# EAGLE board BMS_24 (EAGLE 9.6.2)
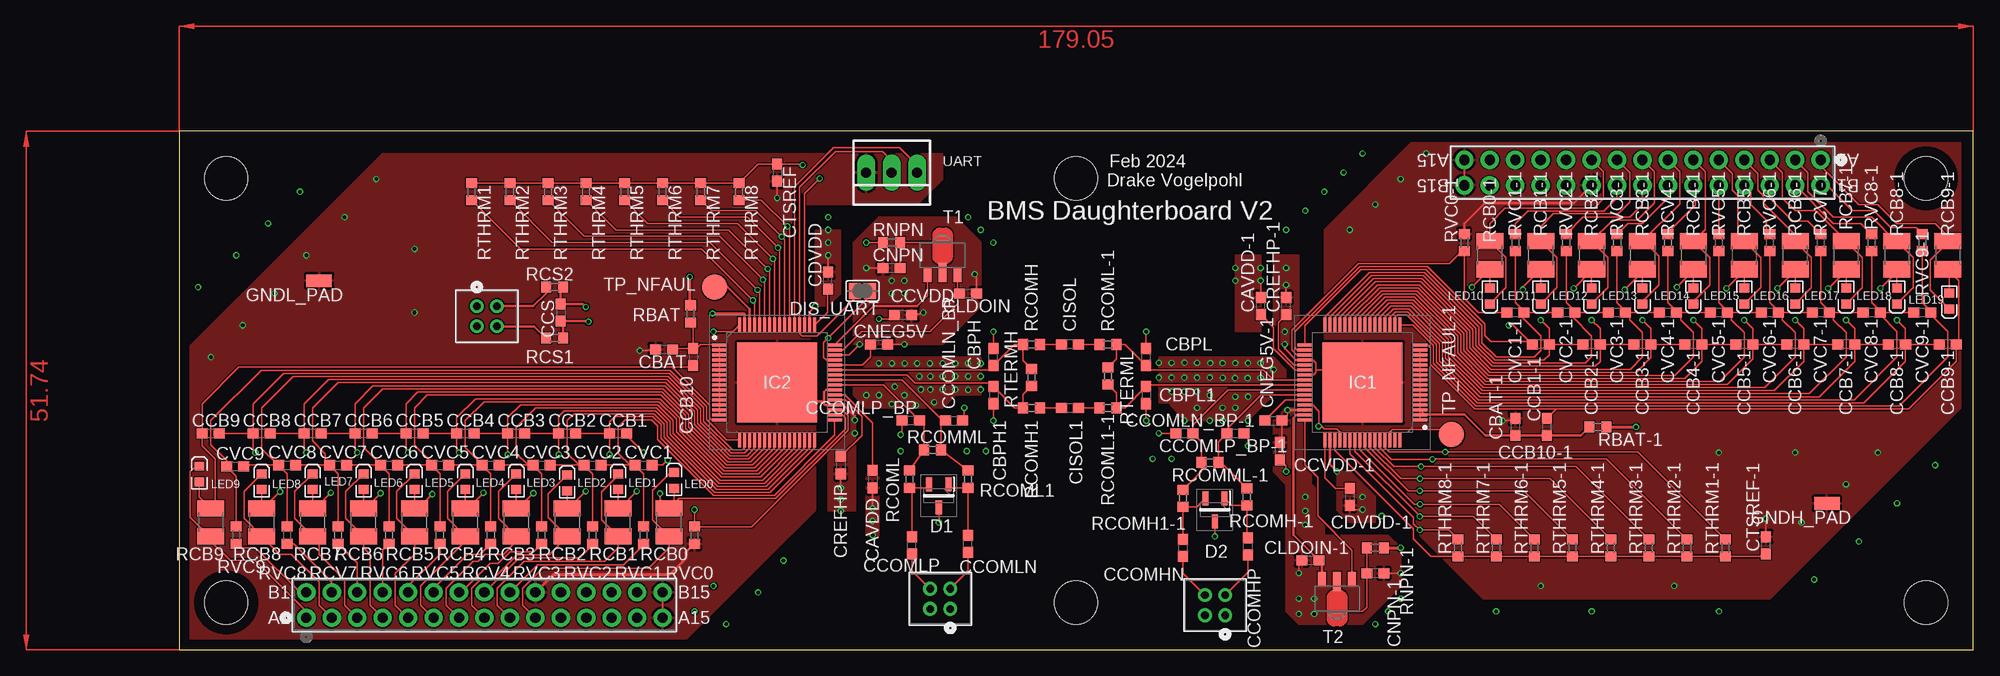
[diagram p1: board, top side]
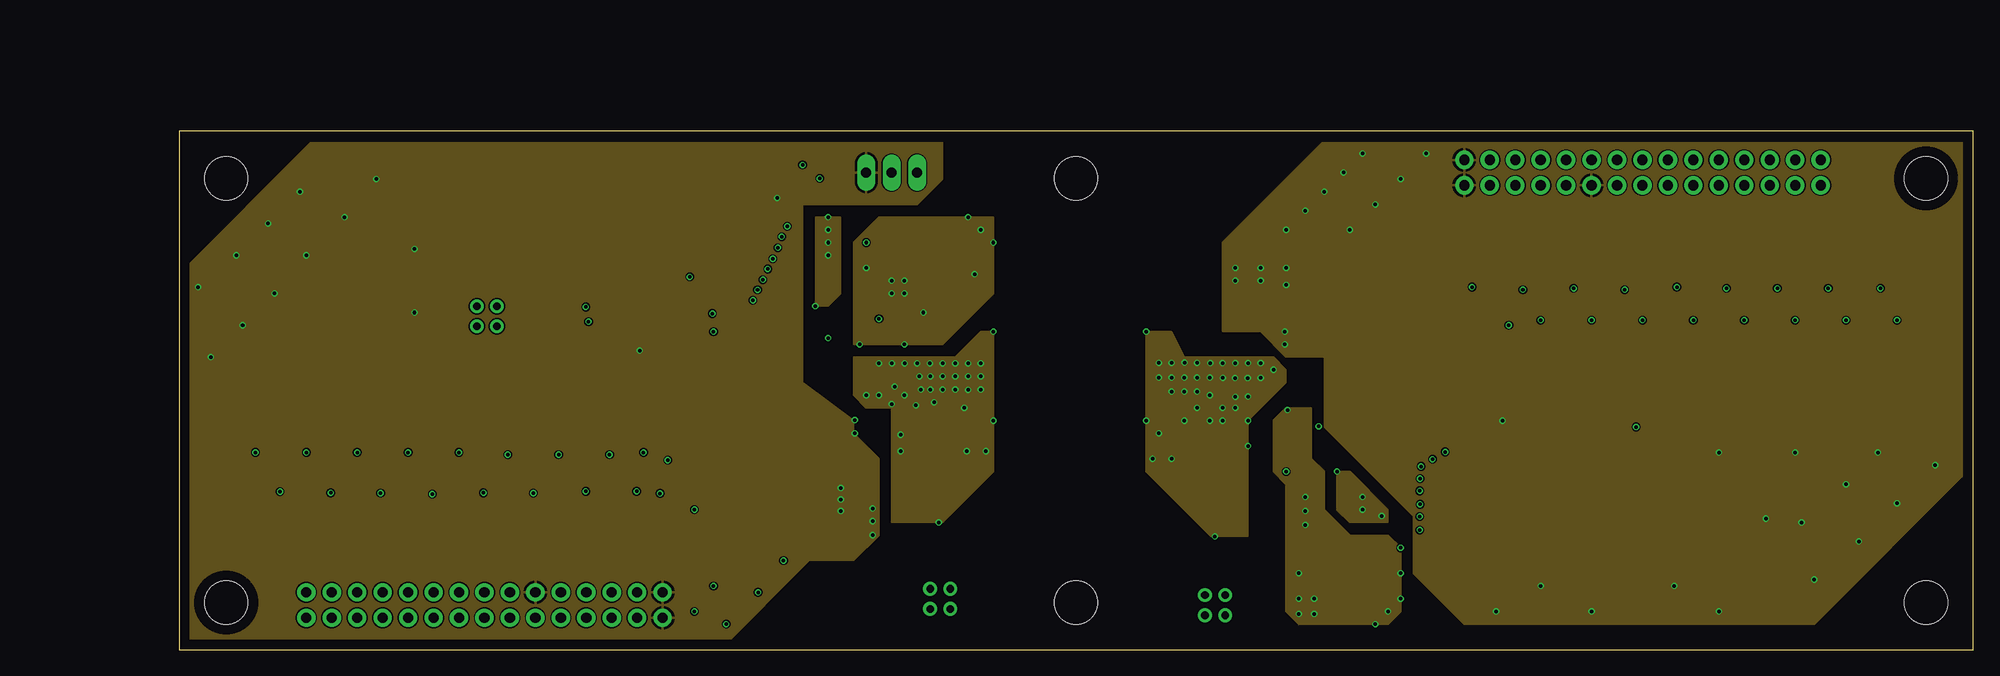
[diagram p2: board, inner layer Route2]
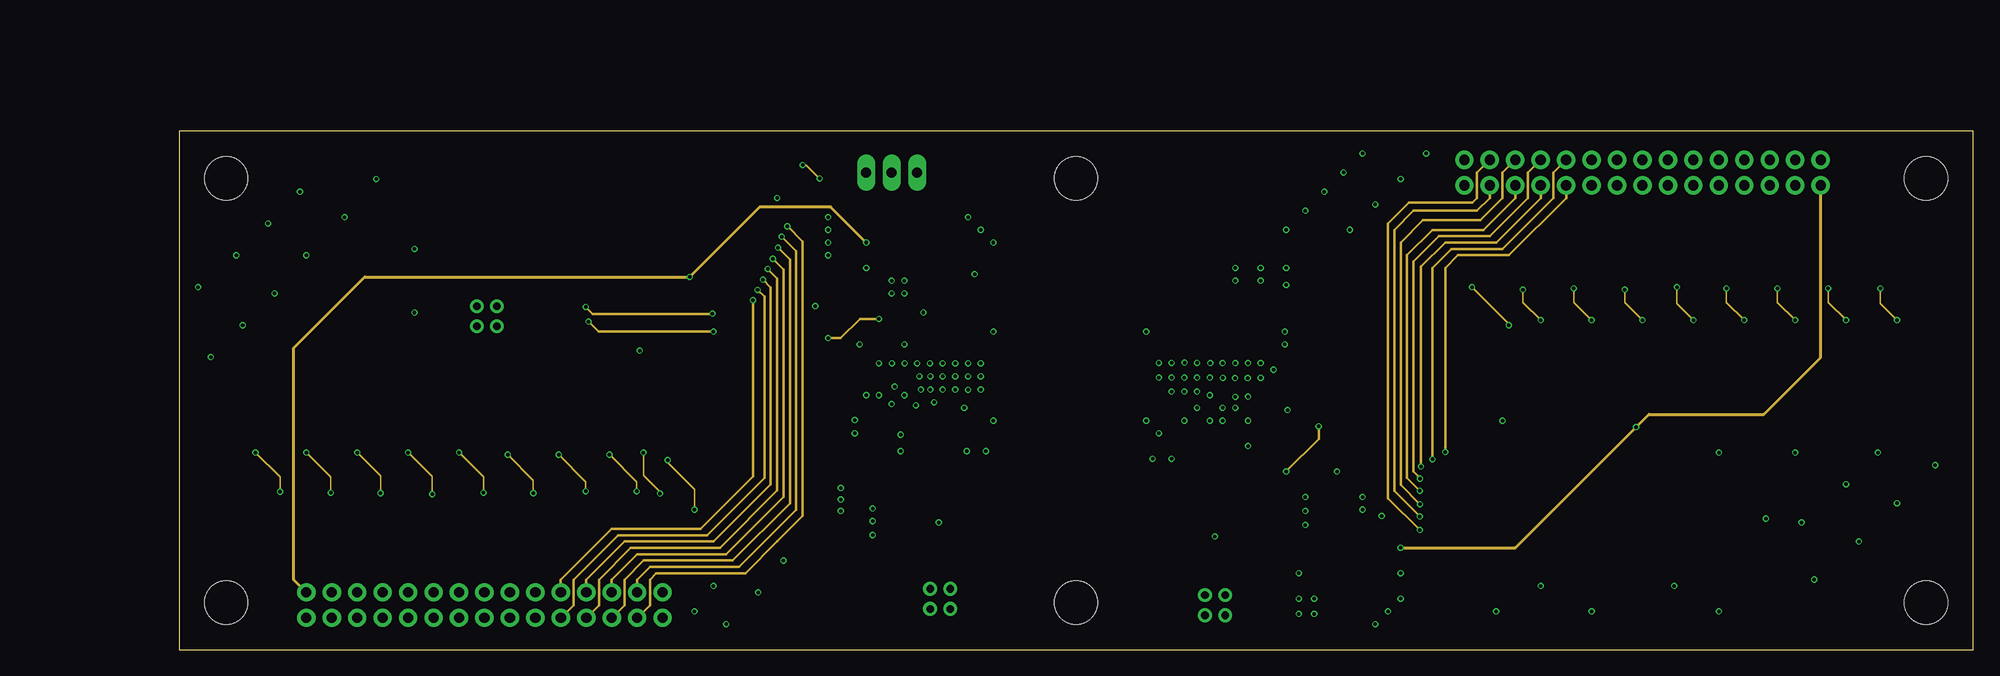
[diagram p3: board, inner layer Route15]
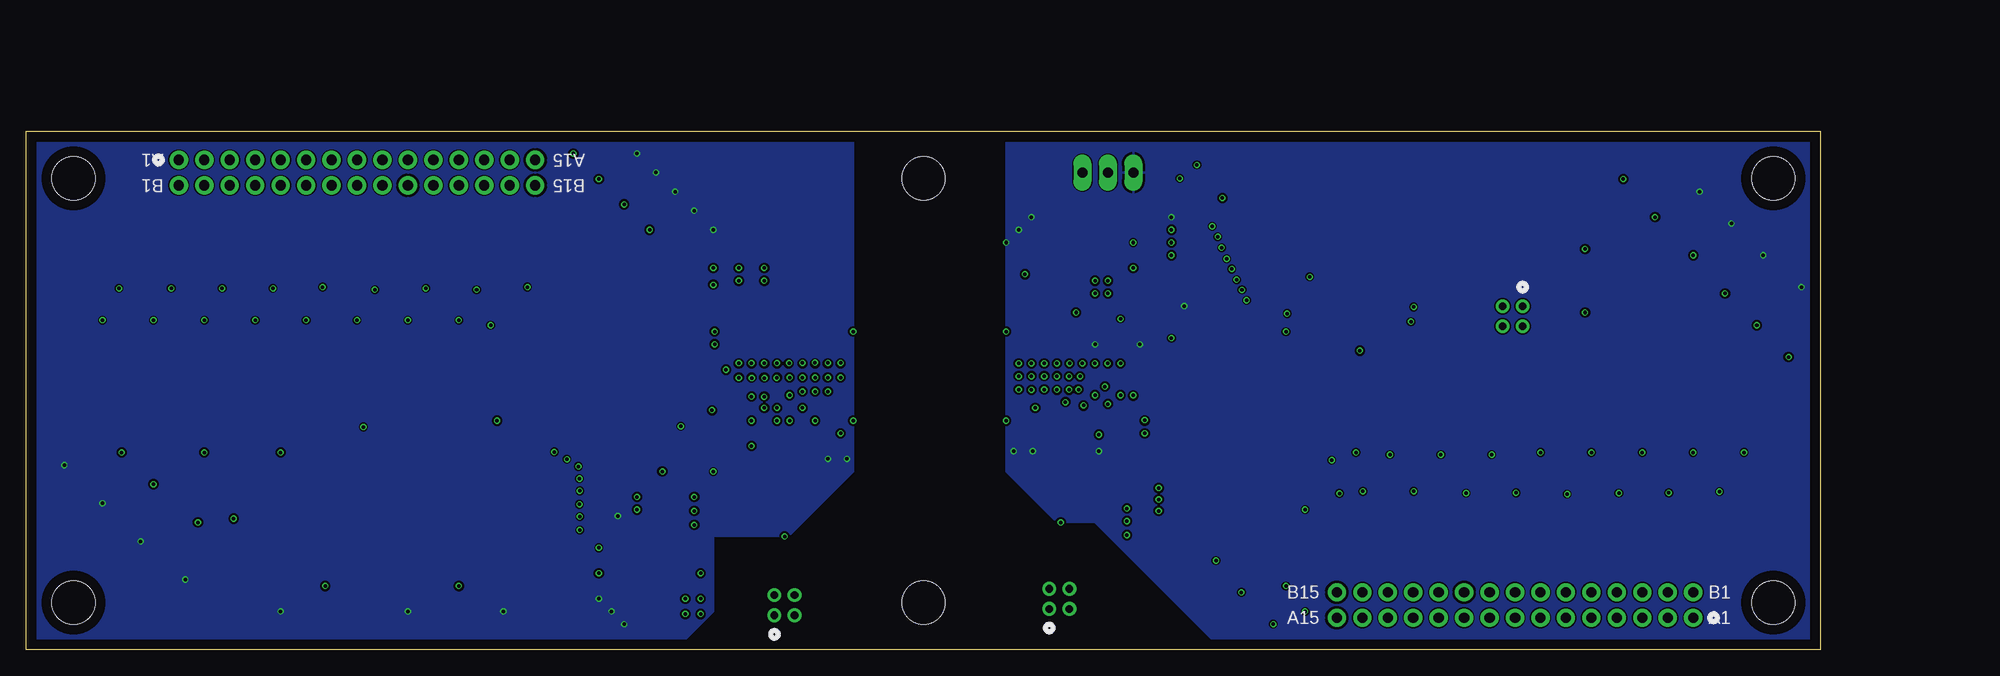
[diagram p4: board, bottom side, seen from below]

Size 179.05 x 51.74 mm. Coordinates in mm from the lower left corner, seen from the top.
Outline: 0,0 179.05,0 179.05,51.74 0,51.74 0,0
Copper layers (1+2*15+16): Top 0.035mm / dielectric 0.2mm / Route2 0.0175mm / dielectric 1.065mm / Route15 0.0175mm / dielectric 0.2mm / Bottom 0.035mm
Design rules "jlcpcb-4layers *": minimum track width 3.5mil, minimum drill 0.2mm, track to track 5mil, track to pad 0.2mm, pad to pad 5mil, via to via 0.5mm, smd to smd 5mil, copper to edge 40mil, drill to drill 6mil, minimum pad ring 10mil, minimum via ring 0.13mm, stop-mask expansion 0.05mm, vias tented up to drill 16mil, thermal gap 10mil
Holes 4.32 mm at 4.7,47.04 4.7,4.7 174.35,47.04 174.35,4.7 89.52,47.04 89.52,4.7
bRestrict: area 73.4,28.3 to 73.9,28.8; area 74.7,28.3 to 75.2,28.8; area 75.9,28.3 to 76.5,28.8; area 77.2,28.3 to 77.7,28.8; area 78.5,28.3 to 79,28.8; area 79.8,28.3 to 80.3,28.8; area 79.8,27.1 to 80.3,27.6; area 70.9,28.3 to 71.4,28.8; area 72.1,28.3 to 72.6,28.8; area 69.6,28.3 to 70.1,28.8; area 75.9,27.1 to 76.5,27.6; area 77.2,27.1 to 77.7,27.6; 126 more areas

## Footprints (pad centres in the part's own frame; a part is rotated, then mirrored left to right if it is on the bottom)
C0603 = smd 1.1 x 1: 1 -0.85,0; 2 0.85,0
CON4_2X2_UF_DF11_HIR = drill 0.762 pad 1.27: 1 0,0; 2 0,2.007; 3 -2.007,0; 4 -2.007,2.007
SOT95P255X150-3N = smd 1.4 x 0.6: 1 -1.15,0.95; 2 -1.15,-0.95; 3 1.15,0
SJ = smd 1.168 x 1.6: 1 -0.762,0; 2 0.762,0
SMD1,27-2,54 = smd 1.27 x 2.54: 1 0,0
87606-315LF_AMP = drill 1.016 pad 1.524: 1 0,0; 2 2.54,0; 3 5.08,0; 4 7.62,0; 5 10.16,0; 6 12.7,0; 7 15.24,0; 8 17.78,0; 9 20.32,0; 10 22.86,0; 11 25.4,0; 12 27.94,0; 13 30.48,0; 14 33.02,0; 15 35.56,0; 16 0,2.54; 17 2.54,2.54; 18 5.08,2.54; 19 7.62,2.54; 20 10.16,2.54; 21 12.7,2.54; 22 15.24,2.54; 23 17.78,2.54; 24 20.32,2.54; 25 22.86,2.54; 26 25.4,2.54; 27 27.94,2.54; 28 30.48,2.54; 29 33.02,2.54; 30 35.56,2.54
QFP50P1200X1200X120-65N = smd 1.475 x 0.3: 1 -5.738,3.75; 2 -5.738,3.25; 3 -5.738,2.75; 4 -5.738,2.25; 5 -5.738,1.75; 6 -5.738,1.25; 7 -5.738,0.75; 8 -5.738,0.25; 9 -5.738,-0.25; 10 -5.738,-0.75; 11 -5.738,-1.25; 12 -5.738,-1.75; 13 -5.738,-2.25; 14 -5.738,-2.75; 15 -5.738,-3.25; 16 -5.738,-3.75; 33 5.738,-3.75; 34 5.738,-3.25; 35 5.738,-2.75; 36 5.738,-2.25; 37 5.738,-1.75; 38 5.738,-1.25; 39 5.738,-0.75; 40 5.738,-0.25; 41 5.738,0.25; 42 5.738,0.75; 43 5.738,1.25; 44 5.738,1.75; 45 5.738,2.25; 46 5.738,2.75; 47 5.738,3.25; 48 5.738,3.75 | smd 0.3 x 1.475: 17 -3.75,-5.738; 18 -3.25,-5.738; 19 -2.75,-5.738; 20 -2.25,-5.738; 21 -1.75,-5.738; 22 -1.25,-5.738; 23 -0.75,-5.738; 24 -0.25,-5.738; 25 0.25,-5.738; 26 0.75,-5.738; 27 1.25,-5.738; 28 1.75,-5.738; 29 2.25,-5.738; 30 2.75,-5.738; 31 3.25,-5.738; 32 3.75,-5.738; 49 3.75,5.738; 50 3.25,5.738; 51 2.75,5.738; 52 2.25,5.738; 53 1.75,5.738; 54 1.25,5.738; 55 0.75,5.738; 56 0.25,5.738; 57 -0.25,5.738; 58 -0.75,5.738; 59 -1.25,5.738; 60 -1.75,5.738; 61 -2.25,5.738; 62 -2.75,5.738; 63 -3.25,5.738; 64 -3.75,5.738 | smd 8 x 8: 65 0,0
TJ-S1608SW6TNPGLCRB-A5 = smd 0.889 x 0.991: 1 -0.787,0; 2 0.787,0
R0603 = smd 1 x 1.1: 1 -0.85,0; 2 0.85,0
R1210 = smd 1.6 x 2.7: 1 -1.4,0; 2 1.4,0
SOT89-BCE = smd 0.8 x 1.4: B -1.499,-1.981; E 1.499,-1.981 | smd 0.8 x 1.9: C 0,-1.727
B2,54 = smd 2.54 x 2.54: TP 0,0
22-23-2031 = drill 1 long: 1 -2.54,0; 2 0,0; 3 2.54,0

## Placement (x,y rotation side)
CAVDD  1uF  [C0603]  69.22,17.02 270 top
CAVDD-1  1uF  [C0603]  107.95,34.29 90 top
CBAT  10nF  [C0603]  48.39,29.97 0 top
CBAT-1  10nF  [C0603]  133.35,22.23 270 top
CBPH  220pF  [C0603]  81.28,29.21 90 top
CBPH1  220pF  [C0603]  81.28,25.4 270 top
CBPL  220pF  [C0603]  96.52,29.21 90 top
CBPL1  220pF  [C0603]  96.52,25.4 270 top
CCB1  0.47uF  [C0603]  43.81,21.59 0 top
CCB1-1  0.47uF  [C0603]  135.89,30.48 180 top
CCB2  0.47uF  [C0603]  38.73,21.59 0 top
CCB2-1  0.47uF  [C0603]  140.97,30.48 180 top
CCB3  0.47uF  [C0603]  33.66,21.59 0 top
CCB3-1  0.47uF  [C0603]  146.05,30.48 180 top
CCB4  0.47uF  [C0603]  28.57,21.59 0 top
CCB4-1  0.47uF  [C0603]  151.13,30.48 180 top
CCB5  0.47uF  [C0603]  23.5,21.59 0 top
CCB5-1  0.47uF  [C0603]  156.21,30.48 180 top
CCB6  0.47uF  [C0603]  18.41,21.59 0 top
CCB6-1  0.47uF  [C0603]  161.29,30.48 180 top
CCB7  0.47uF  [C0603]  13.34,21.59 0 top
CCB7-1  0.47uF  [C0603]  166.37,30.48 180 top
CCB8  0.47uF  [C0603]  8.26,21.59 0 top
CCB8-1  0.47uF  [C0603]  171.45,30.48 180 top
CCB9  0.47uF  [C0603]  3.17,21.59 0 top
CCB9-1  0.47uF  [C0603]  176.53,30.48 180 top
CCB10  0.47uF  [C0603]  51.31,29.21 270 top
CCB10-1  0.47uF  [C0603]  136.53,22.23 90 top
CCOMHN  2.2nF  [C0603]  100.2,10.16 90 top
CCOMHP  2.2nF  [C0603]  106.68,10.29 90 top
CCOMLN  2.2nF  [C0603]  78.74,10.54 90 top
CCOMLN_BP  220pF  [C0603]  77.34,22.86 0 top
CCOMLN_BP-1  220pF  [C0603]  100.33,21.59 180 top
CCOMLP  2.2nF  [C0603]  73.15,10.41 90 top
CCOMLP_BP  220pF  [C0603]  73.03,22.86 180 top
CCOMLP_BP-1  220pF  [C0603]  105.41,21.59 0 top
CCS  0.47uF  [C0603]  38.1,33.66 270 top
CCVDD  4.7uF  [C0603]  72.26,33.4 0 top
CCVDD-1  4.7uF  [C0603]  109.86,19.81 90 top
CDVDD  1uF  [C0603]  64.77,36.83 90 top
CDVDD-1  1uF  [C0603]  116.84,15.24 270 top
CISOL  2.2nF  [C0603]  88.9,30.48 180 top
CISOL1  2.2nF  [C0603]  88.9,24.13 180 top
CLDOIN  0.1uF  [C0603]  78.74,35.56 0 top
CLDOIN-1  0.1uF  [C0603]  112.9,8.89 180 top
CNEG5V  0.1uF  [C0603]  69.85,30.48 0 top
CNEG5V-1  0.1uF  [C0603]  109.22,22.86 0 top
CNPN  0.22uF  [C0603]  71.12,38.1 0 top
CNPN-1  0.22uF  [C0603]  119.38,7.62 180 top
COMMH  DF11-4DP-2DSA(24)  [CON4_2X2_UF_DF11_HIR]  104.39,3.43 0 top
COMML  DF11-4DP-2DSA(24)  [CON4_2X2_UF_DF11_HIR]  76.96,4.06 0 top
CREFHP  1uF  [C0603]  66.04,18.41 270 top
CREFHP-1  1uF  [C0603]  110.49,34.29 90 top
CTSREF  1uF  [C0603]  59.69,47.62 270 top
CTSREF-1  1uF  [C0603]  158.37,10.41 90 top
CVC1  0.47uF  [C0603]  46.35,18.41 0 top
CVC1-1  0.47uF  [C0603]  133.35,33.66 180 top
CVC2  0.47uF  [C0603]  41.27,18.41 0 top
CVC2-1  0.47uF  [C0603]  138.43,33.66 180 top
CVC3  0.47uF  [C0603]  36.2,18.41 0 top
CVC3-1  0.47uF  [C0603]  143.51,33.66 180 top
CVC4  0.47uF  [C0603]  31.11,18.41 0 top
CVC4-1  0.47uF  [C0603]  148.59,33.66 180 top
CVC5  0.47uF  [C0603]  26.04,18.41 0 top
CVC5-1  0.47uF  [C0603]  153.67,33.66 180 top
CVC6  0.47uF  [C0603]  20.95,18.41 0 top
CVC6-1  0.47uF  [C0603]  158.75,33.66 180 top
CVC7  0.47uF  [C0603]  15.88,18.41 0 top
CVC7-1  0.47uF  [C0603]  163.83,33.66 180 top
CVC8  0.47uF  [C0603]  10.79,18.41 0 top
CVC8-1  0.47uF  [C0603]  168.91,33.66 180 top
CVC9  0.47uF  [C0603]  5.59,18.29 0 top
CVC9-1  0.47uF  [C0603]  173.99,33.66 180 top
D1  ESDAVLC6-2BLY  [SOT95P255X150-3N]  75.82,15.37 270 top
D2  ESDAVLC6-2BLY  [SOT95P255X150-3N]  103.38,13.97 270 top
DIS_UART  [SJ]  68.2,35.81 180 top
GNDH_PAD  [SMD1,27-2,54]  164.47,14.61 90 top
GNDL_PAD  [SMD1,27-2,54]  13.97,36.83 90 top
HIGH-IN  87606-315LF  [87606-315LF_AMP]  163.83,48.9 180 top
IC1  PBQ79656PAPTQ1  [QFP50P1200X1200X120-65N]  118.11,26.67 180 top
IC2  PBQ79656PAPTQ1  [QFP50P1200X1200X120-65N]  59.69,26.67 0 top
LED0  TJ-S1608SW6TNPGLCRB-A5  [TJ-S1608SW6TNPGLCRB-A5]  49.4,16.89 270 top
LED1  TJ-S1608SW6TNPGLCRB-A5  [TJ-S1608SW6TNPGLCRB-A5]  43.81,16.76 270 top
LED2  TJ-S1608SW6TNPGLCRB-A5  [TJ-S1608SW6TNPGLCRB-A5]  38.73,16.64 270 top
LED3  TJ-S1608SW6TNPGLCRB-A5  [TJ-S1608SW6TNPGLCRB-A5]  33.66,16.76 270 top
LED4  TJ-S1608SW6TNPGLCRB-A5  [TJ-S1608SW6TNPGLCRB-A5]  28.57,16.76 270 top
LED5  TJ-S1608SW6TNPGLCRB-A5  [TJ-S1608SW6TNPGLCRB-A5]  23.5,16.76 270 top
LED6  TJ-S1608SW6TNPGLCRB-A5  [TJ-S1608SW6TNPGLCRB-A5]  18.41,16.76 270 top
LED7  TJ-S1608SW6TNPGLCRB-A5  [TJ-S1608SW6TNPGLCRB-A5]  13.34,16.76 270 top
LED8  TJ-S1608SW6TNPGLCRB-A5  [TJ-S1608SW6TNPGLCRB-A5]  8.26,16.76 270 top
LED9  TJ-S1608SW6TNPGLCRB-A5  [TJ-S1608SW6TNPGLCRB-A5]  2.03,17.53 270 top
LED10  TJ-S1608SW6TNPGLCRB-A5  [TJ-S1608SW6TNPGLCRB-A5]  130.81,35.31 90 top
LED11  TJ-S1608SW6TNPGLCRB-A5  [TJ-S1608SW6TNPGLCRB-A5]  135.89,35.31 90 top
LED12  TJ-S1608SW6TNPGLCRB-A5  [TJ-S1608SW6TNPGLCRB-A5]  140.97,35.31 90 top
LED13  TJ-S1608SW6TNPGLCRB-A5  [TJ-S1608SW6TNPGLCRB-A5]  146.05,35.31 90 top
LED14  TJ-S1608SW6TNPGLCRB-A5  [TJ-S1608SW6TNPGLCRB-A5]  151.13,35.31 90 top
LED15  TJ-S1608SW6TNPGLCRB-A5  [TJ-S1608SW6TNPGLCRB-A5]  156.21,35.31 90 top
LED16  TJ-S1608SW6TNPGLCRB-A5  [TJ-S1608SW6TNPGLCRB-A5]  161.29,35.31 90 top
LED17  TJ-S1608SW6TNPGLCRB-A5  [TJ-S1608SW6TNPGLCRB-A5]  166.37,35.31 90 top
LED18  TJ-S1608SW6TNPGLCRB-A5  [TJ-S1608SW6TNPGLCRB-A5]  171.45,35.31 90 top
LED19  TJ-S1608SW6TNPGLCRB-A5  [TJ-S1608SW6TNPGLCRB-A5]  176.66,34.8 90 top
LOW-IN  87606-315LF  [87606-315LF_AMP]  12.7,3.17 0 top
RBAT  30  [R0603]  51.05,33.53 270 top
RBAT-1  30  [R0603]  141.6,22.23 180 top
RCB0  10  [R1210]  48.9,12.7 90 top
RCB0-1  10  [R1210]  130.81,39.37 270 top
RCB1  10  [R1210]  43.81,12.7 90 top
RCB1-1  10  [R1210]  135.89,39.37 270 top
RCB2  10  [R1210]  38.73,12.7 90 top
RCB2-1  10  [R1210]  140.97,39.37 270 top
RCB3  10  [R1210]  33.66,12.7 90 top
RCB3-1  10  [R1210]  146.05,39.37 270 top
RCB4  10  [R1210]  28.57,12.7 90 top
RCB4-1  10  [R1210]  151.13,39.37 270 top
RCB5  10  [R1210]  23.5,12.7 90 top
RCB5-1  10  [R1210]  156.21,39.37 270 top
RCB6  10  [R1210]  18.41,12.7 90 top
RCB6-1  10  [R1210]  161.29,39.37 270 top
RCB7  10  [R1210]  13.34,12.7 90 top
RCB7-1  10  [R1210]  166.37,39.37 270 top
RCB8  10  [R1210]  8.26,12.7 90 top
RCB8-1  10  [R1210]  171.45,39.37 270 top
RCB9  10  [R1210]  3.17,12.7 90 top
RCB9-1  10  [R1210]  176.53,39.37 270 top
RCOMH  49  [R0603]  85.09,30.48 180 top
RCOMH1  49  [R0603]  85.09,24.13 180 top
RCOMH1-1  49  [R0603]  100.2,15.11 90 top
RCOMH-1  49  [R0603]  106.55,15.24 90 top
RCOML  49  [R0603]  72.9,17.02 90 top
RCOML1  49  [R0603]  78.74,17.02 90 top
RCOML1-1  49  [R0603]  92.71,24.13 0 top
RCOML-1  49  [R0603]  92.71,30.48 0 top
RCOMML  1k  [R0603]  75.18,19.94 0 top
RCOMML-1  1k  [R0603]  102.87,18.67 0 top
RCS1  10  [R0603]  37.47,31.11 180 top
RCS2  10  [R0603]  37.47,36.2 180 top
RCV4  100  [R0603]  31.11,11.43 90 top
RCV4-1  100  [R0603]  148.59,40.64 270 top
RCV7  100  [R0603]  15.88,11.43 90 top
RCV7-1  100  [R0603]  163.83,40.64 270 top
RNPN  49  [R0603]  71.12,40.64 0 top
RNPN-1  49  [R0603]  119.38,10.16 180 top
RTERMH  1k  [R0603]  85.09,27.18 90 top
RTERML  1k  [R0603]  92.71,27.3 270 top
RTHRM1  10k  [R0603]  29.21,45.72 270 top
RTHRM1-1  10k  [R0603]  154.31,10.16 90 top
RTHRM2  10k  [R0603]  33.02,45.72 270 top
RTHRM2-1  10k  [R0603]  150.5,10.16 90 top
RTHRM3  10k  [R0603]  36.83,45.72 270 top
RTHRM3-1  10k  [R0603]  146.69,10.16 90 top
RTHRM4  10k  [R0603]  40.64,45.72 270 top
RTHRM4-1  10k  [R0603]  142.88,10.16 90 top
RTHRM5  10k  [R0603]  44.45,45.72 270 top
RTHRM5-1  10k  [R0603]  139.06,10.16 90 top
RTHRM6  10k  [R0603]  48.26,45.72 270 top
RTHRM6-1  10k  [R0603]  135.25,10.16 90 top
RTHRM7  10k  [R0603]  52.07,45.72 270 top
RTHRM7-1  10k  [R0603]  131.44,10.16 90 top
RTHRM8  10k  [R0603]  55.88,45.72 270 top
RTHRM8-1  10k  [R0603]  127.64,10.16 90 top
RVC0  100  [R0603]  51.44,11.43 90 top
RVC0-1  100  [R0603]  128.27,40.64 270 top
RVC1  100  [R0603]  46.35,11.43 90 top
RVC1-1  100  [R0603]  133.35,40.64 270 top
RVC2  100  [R0603]  41.27,11.43 90 top
RVC2-1  100  [R0603]  138.43,40.64 270 top
RVC3  100  [R0603]  36.2,11.43 90 top
RVC3-1  100  [R0603]  143.51,40.64 270 top
RVC5  100  [R0603]  26.04,11.43 90 top
RVC5-1  100  [R0603]  153.67,40.64 270 top
RVC6  100  [R0603]  20.95,11.43 90 top
RVC6-1  100  [R0603]  158.75,40.64 270 top
RVC8  100  [R0603]  10.79,11.43 90 top
RVC8-1  100  [R0603]  168.91,40.64 270 top
RVC9  100  [R0603]  5.71,11.43 90 top
RVC9-1  100  [R0603]  173.99,40.64 270 top
SR  DF11-4DP-2DSA(24)  [CON4_2X2_UF_DF11_HIR]  29.72,34.29 180 top
T1  PBHV8115X, 115  [SOT89-BCE]  76.2,39.37 0 top
T2  PBHV8115X, 115  [SOT89-BCE]  115.57,5.08 180 top
TP_NFAUL  TPB2,54  [B2,54]  53.47,36.2 180 top
TP_NFAUL-1  TPB2,54  [B2,54]  127,21.46 0 top
UART  22-23-2031  [22-23-2031]  71.12,47.62 180 top

## Tracks (layer width: path | path; a pad name or v marks a point on that pad's centre or on a via)
AVDD
  Top 0.152: IC2.38 66.45,25.42 69.22,22.65 CAVDD.1
AVDD-1
  Top 0.152: IC1.38 111.36,27.91 109.22,30.05 109.22,32.17 CAVDD-1.1
BAT  (via drill 0.35)
  Top 0.152: RNPN.1 v68.58,40.64 | LOW-IN.16 12.06,5.71 7.62,10.16 6.13,10.16 RVC9.1
  Top 0.305: v50.97,37.21 | v50.97,37.21 50.97,34.47 RBAT.1
  Route15 0.305: v68.58,40.64 65.02,44.2 57.95,44.2 v50.97,37.21 18.54,37.21 11.43,30.1 11.43,6.99 LOW-IN.16
BAT-1  (via drill 0.35)
  Top 0.152: HIGH-IN.16 164.47,46.35 167,43.81 169.12,43.81 170.81,42.12 173.35,42.12 RVC9-1.1
  Top 0.305: RNPN-1.1 v121.92,10.16 | RBAT-1.1 v145.41,22.23
  Route15 0.305: HIGH-IN.16 163.83,29.17 158.15,23.5 146.69,23.5 v145.41,22.23 133.35,10.16 v121.92,10.16
CB0  (via drill 0.35)
  Top 0.152: v46.35,19.68 44.66,21.38 CCB1.2 | IC2.34 66.22,23.42 66.5,23.14 66.5,22.05 59.54,15.09 49.88,15.09 RCB0.2 | RCB0.2 48.01,14.99 v48.01,15.6 | RCB0.2 49.4,14.61 LED0.2
  Route15 0.152: v46.35,19.68 46.35,17.4 48.01,15.75 v48.01,15.6
CB0-1  (via drill 0.35)
  Top 0.152: IC1.34 111.58,29.92 111.36,30.15 111.36,31.78 117.83,38.25 124.56,38.25 130.3,32.51 130.3,31.38 130.93,30.76 134.76,30.76 CCB1-1.2 133.13,32.38 v132.72,32.38 | 130.69,37.84 130.43,37.59 v129.03,36.2 | 130.69,37.84 RCB0-1.2 | LED10.2 130.81,37.72 130.69,37.84
  Route15 0.152: v132.72,32.38 132.72,32.51 v129.03,36.2
CB0-IN
  Top 0.152: LOW-IN.10 34.29,4.45 34.29,6.13 36.28,8.12 46.85,8.12 48.9,10.16 RCB0.1 47.24,12.95 47.24,15.88 49.05,17.68 LED0.1
CB0-IN-1
  Top 0.152: HIGH-IN.10 142.16,47.7 142.16,45.01 141.22,44.07 132.33,44.07 130.81,42.55 RCB0-1.1 132.44,39.14 132.44,36.13 LED10.1
CB1  (via drill 0.35)
  Top 0.152: CCB2.2 CCB1.1 | v45.67,15.8 45.67,15.78 44.16,14.26 44.07,14.35 RCB1.2 LED1.2 | v42.96,19.47 v42.97,19.47 CCB1.1 | CCB1.1 42.97,22.72 43.51,23.27 47.28,23.27 48.08,22.46 48.08,21.09 53.47,15.7 58.99,15.7 63.44,20.14 IC2.32
  Route15 0.152: v45.67,15.8 45.67,16.76 v42.96,19.47
CB1-1  (via drill 0.35)
  Top 0.152: RCB1-1.2 135.7,37.78 | 135.7,37.78 134.11,36.19 v134.11,35.94 | CCB2-1.2 CCB1-1.1 | IC1.32 114.36,33.2 118.81,37.64 124.3,37.64 129.74,32.2 129.74,30.48 131.32,28.91 136.22,28.91 136.74,29.43 CCB1-1.1 | CCB1-1.1 136.74,32.04 v135.89,32.89 | LED11.2 135.89,37.59 135.7,37.78
  Route15 0.152: v134.11,35.94 134.11,34.67 v135.89,32.89
CB1-IN
  Top 0.152: LOW-IN.9 31.75,4.45 31.75,6.13 34.44,8.81 42.47,8.81 43.81,10.16 RCB1.1 42.16,12.95 42.16,15.75 43.81,17.4 LED1.1
CB1-IN-1
  Top 0.152: HIGH-IN.9 144.78,47.62 144.78,44.67 143.62,43.51 137.16,43.51 135.89,42.24 RCB1-1.1 137.52,39.14 137.52,36.15 LED11.1
CB2  (via drill 0.35)
  Top 0.152: CCB3.2 CCB2.1 | v37.88,19.47 CCB2.1 | CCB2.1 37.88,23.28 38.43,23.82 47.56,23.82 48.72,22.67 48.72,21.34 53.75,16.31 58.6,16.31 62.44,20.14 IC2.30 | v40.59,15.8 39.02,14.23 38.86,14.23 RCB2.2 LED2.2
  Route15 0.152: v40.59,15.8 40.59,16.76 v37.88,19.47
CB2-1  (via drill 0.35)
  Top 0.152: CCB3-1.2 CCB2-1.1 | IC1.30 115.36,33.2 119.2,37.03 124.05,37.03 129.13,31.95 129.13,30.23 131.07,28.3 141.33,28.3 141.82,28.79 CCB2-1.1 | CCB2-1.1 141.82,32.04 v140.97,32.89 | 140.91,37.91 140.84,37.84 140.97,37.72 LED12.2 | 140.91,37.91 RCB2-1.2 | v139.19,36.07 140.91,37.78 140.91,37.91
  Route15 0.152: v139.19,36.07 139.19,34.67 v140.97,32.89
CB2-IN
  Top 0.152: LOW-IN.8 29.21,4.45 29.21,6.13 30.14,7.06 31.35,7.06 33.76,9.47 36.91,9.47 RCB2.1 36.85,13.18 36.85,15.54 LED2.1
CB2-IN-1
  Top 0.152: HIGH-IN.8 147.24,47.7 147.24,44.59 145.55,42.9 143.1,42.9 RCB2-1.1 142.6,39.14 142.6,36.15 LED12.1
CB3  (via drill 0.35)
  Top 0.152: CCB3.1 CCB4.2 | v32.8,19.47 CCB3.1 | CCB3.1 32.8,23.16 34.08,24.43 47.77,24.43 49.33,22.88 49.33,21.59 54,16.92 58.24,16.92 61.44,20.12 IC2.28 | LED3.2 33.66,14.22 | 33.66,14.22 RCB3.2 | v35.36,15.62 33.96,14.22 33.66,14.22
  Route15 0.152: v35.36,15.62 35.36,16.91 v32.8,19.47
CB3-1  (via drill 0.35)
  Top 0.152: CCB4-1.2 CCB3-1.1 | IC1.28 116.36,33.2 119.59,36.42 123.8,36.42 128.52,31.7 128.52,29.98 130.81,27.69 145.41,27.69 146.9,29.17 CCB3-1.1 | CCB3-1.1 146.9,32.04 v146.05,32.89 | RCB3-1.2 145.92,37.84 145.92,37.59 | v144.27,35.94 145.92,37.59 | LED13.2 146.05,37.47 145.92,37.59
  Route15 0.152: v144.27,35.94 144.27,34.67 v146.05,32.89
CB3-IN
  Top 0.152: LOW-IN.7 26.67,4.45 26.67,6.13 29.35,8.81 29.84,8.81 30.56,9.53 32.38,9.53 33.66,10.79 RCB3.1 31.88,13.08 31.88,15.77 LED3.1
CB3-IN-1
  Top 0.152: HIGH-IN.7 149.78,47.7 149.78,44.5 RCB3-1.1 146.18,40.77 147.68,39.27 147.68,36.39 146.05,34.76 LED13.1
CB4  (via drill 0.35)
  Top 0.152: CCB5.2 CCB4.1 | v27.94,19.68 27.73,19.9 CCB4.1 | CCB4.1 27.73,23.19 29.58,25.04 48.03,25.04 49.94,23.14 49.94,21.84 54.25,17.53 57.82,17.53 60.44,20.14 IC2.26 | v30.38,15.65 29.34,14.61 28.93,14.61 28.93,14.45 RCB4.2 LED4.2
  Route15 0.152: v27.94,19.68 30.38,17.25 v30.38,15.65
CB4-1  (via drill 0.35)
  Top 0.152: CCB5-1.2 CCB4-1.1 | IC1.26 117.36,33.2 119.98,35.81 123.55,35.81 127.91,31.44 127.91,29.72 130.56,27.08 150.27,27.08 151.98,28.79 CCB4-1.1 | CCB4-1.1 151.98,32.04 v151.13,32.89 | 151,37.84 150.81,37.65 150.81,37.53 v149.48,36.2 | 151,37.84 RCB4-1.2 | LED14.2 151.13,37.72 151,37.84
  Route15 0.152: v149.48,36.2 149.48,34.54 v151.13,32.89
CB4-IN
  Top 0.152: LOW-IN.6 24.13,4.45 24.13,6.35 28.57,10.79 RCB4.1 26.8,13.08 26.8,15.77 LED4.1
CB4-IN-1
  Top 0.152: HIGH-IN.6 152.32,47.7 152.32,41.96 RCB4-1.1 152.76,39.14 152.76,36.39 151.13,34.76 LED14.1
CB5  (via drill 0.35)
  Top 0.152: CCB6.2 CCB5.1 | v22.86,19.68 22.64,19.9 CCB5.1 | CCB5.1 22.64,24.55 23.8,25.7 48.23,25.7 50.55,23.39 50.55,22.09 54.5,18.14 57.43,18.14 59.44,20.14 IC2.24 | RCB5.2 23.5,14.35 | 23.5,14.35 LED5.2 | v25.27,15.52 24.11,14.35 23.5,14.35
  Route15 0.152: v22.86,19.68 25.27,17.27 v25.27,15.52
CB5-1  (via drill 0.35)
  Top 0.152: CCB6-1.2 CCB5-1.1 | IC1.24 118.36,33.2 120.37,35.2 123.29,35.2 127.31,31.19 127.31,29.47 130.31,26.47 154.52,26.47 157.06,29.01 CCB5-1.1 | CCB5-1.1 157.06,32.04 v156.21,32.89 | 156.08,37.84 155.86,37.62 155.86,37.5 v154.43,36.07 | 156.08,37.84 RCB5-1.2 | LED15.2 156.21,37.72 156.08,37.84
  Route15 0.152: v154.43,36.07 154.43,34.67 v156.21,32.89
CB5-IN
  Top 0.152: LOW-IN.5 21.59,4.45 21.59,7.62 23.5,9.53 RCB5.1 21.72,13.08 21.72,15.77 LED5.1
CB5-IN-1
  Top 0.152: HIGH-IN.5 155.02,47.55 155.02,45.86 155.57,45.31 155.57,41.41 RCB5-1.1 157.84,39.14 157.84,36.83 157.84,36.8 157.84,36.15 LED15.1
CB6  (via drill 0.35)
  Top 0.152: CCB7.2 CCB6.1 | v17.78,19.68 17.57,19.9 CCB6.1 | CCB6.1 17.57,24.55 19.33,26.31 48.48,26.31 51.16,23.64 51.16,22.35 54.76,18.75 57.04,18.75 58.44,20.14 IC2.22 | RCB6.2 18.41,14.22 | 18.41,14.22 LED6.2 | v20.12,15.62 18.72,14.22 18.41,14.22
  Route15 0.152: v17.78,19.68 20.12,17.35 v20.12,15.62
CB6-1  (via drill 0.35)
  Top 0.152: CCB7-1.2 CCB6-1.1 | IC1.22 119.36,33.2 120.76,34.59 123.04,34.59 126.69,30.94 126.69,29.22 130.06,25.86 159.21,25.86 162.14,28.79 CCB6-1.1 | CCB6-1.1 162.14,32.04 v161.29,32.89 | 161.23,37.91 161.1,37.78 161.1,37.66 v159.51,36.07 | 161.23,37.91 RCB6-1.2 | LED16.2 161.29,37.85 161.23,37.91
  Route15 0.152: v159.51,36.07 159.51,34.67 v161.29,32.89
CB6-IN
  Top 0.152: LOW-IN.4 19.05,4.45 19.05,9.53 18.41,10.16 RCB6.1 16.64,13.08 16.64,15.77 LED6.1
CB6-IN-1
  Top 0.152: HIGH-IN.4 157.56,47.55 157.56,45.86 158.12,45.31 158.12,44.58 161.29,41.41 RCB6-1.1 162.92,39.14 162.92,36.15 LED16.1
CB7  (via drill 0.35)
  Top 0.152: CCB8.2 CCB7.1 | v12.7,19.68 12.48,19.9 CCB7.1 | CCB7.1 12.48,24.55 14.91,26.98 48.68,26.98 51.74,23.92 51.74,22.6 54.98,19.36 56.68,19.36 57.44,20.12 IC2.20 | RCB7.2 13.34,14.22 | 13.34,14.22 LED7.2 | v15.14,15.65 13.72,14.22 13.34,14.22
  Route15 0.152: v12.7,19.68 15.14,17.25 v15.14,15.65
CB7-1  (via drill 0.35)
  Top 0.152: CCB8-1.2 CCB7-1.1 | IC1.20 120.36,33.2 121.17,34.01 122.76,34.01 126.09,30.69 126.09,28.97 129.8,25.25 163.68,25.25 167.22,28.79 CCB7-1.1 | CCB7-1.1 167.22,32.04 v166.37,32.89 | 166.24,37.84 RCB7-1.2 | v164.59,36.07 166.24,37.72 166.24,37.84 | LED17.2 166.37,37.72 166.24,37.84
  Route15 0.152: v164.59,36.07 164.59,34.67 v166.37,32.89
CB7-IN
  Top 0.152: LOW-IN.3 16.51,4.45 16.51,6.99 13.97,9.53 13.97,10.66 RCB7.1 11.56,13.08 11.56,15.77 LED7.1
CB7-IN-1
  Top 0.152: HIGH-IN.3 160.02,47.62 160.02,45.09 161.29,43.81 163.32,43.81 RCB7-1.1 168,39.14 168,36.83 168,36.8 168,36.15 LED17.1
CB8  (via drill 0.35)
  Top 0.152: CCB9.2 CCB8.1 | v7.62,19.68 7.41,19.9 CCB8.1 | CCB8.1 7.41,24.55 10.44,27.58 48.94,27.58 52.35,24.17 52.35,22.8 55.24,19.91 56.21,19.91 56.44,20.14 IC2.18 | v10.08,15.77 8.54,14.23 8.38,14.23 RCB8.2 LED8.2
  Route15 0.152: v7.62,19.68 10.08,17.22 v10.08,15.77
CB8-1  (via drill 0.35)
  Top 0.152: CCB9-1.2 CCB8-1.1 | IC1.18 121.36,33.2 121.59,33.42 122.54,33.42 125.48,30.48 125.48,28.71 129.55,24.64 168.15,24.64 172.3,28.79 CCB8-1.1 | CCB8-1.1 172.3,32.04 v171.45,32.89 | v169.8,36.07 171.32,37.59 171.32,37.84 RCB8-1.2 LED18.2
  Route15 0.152: v169.8,36.07 169.8,34.54 v171.45,32.89
CB8-IN
  Top 0.152: LOW-IN.2 13.97,4.45 13.97,6.76 11.21,9.53 10.03,9.53 RCB8.1 6.48,13.08 6.48,14.86 6.48,14.94 6.48,15.77 LED8.1
CB8-IN-1
  Top 0.152: 171.51,40.7 173.08,39.14 173.08,36.15 LED18.1 | 171.51,40.7 RCB8-1.1 | HIGH-IN.2 162.56,47.62 162.56,45.72 165.1,43.18 168.91,43.18 171.38,40.7 171.51,40.7
CB9
  Top 0.152: 49.19,28.19 52.94,24.45 52.94,23.15 53.16,22.92 IC2.16 | 49.19,28.19 5.97,28.19 2.33,24.55 CCB9.1 2.33,20.32 3.6,19.05 3.6,14.52 RCB9.2 2.03,15.24 LED9.2 | 49.19,28.19 51.14,28.19 CCB10.2
CB9-1
  Top 0.152: IC1.16 124.63,30.42 124.87,30.18 124.87,28.46 129.3,24.03 137.48,24.03 | 137.48,24.03 172.62,24.03 177.38,28.79 CCB9-1.1 177.63,30.73 177.63,36.87 177.04,37.46 176.66,37.84 | RCB9-1.2 176.66,37.84 | CCB10-1.2 137.48,24.03 | LED19.2 176.66,37.84
CB9-IN
  Top 0.152: LOW-IN.1 12.7,3.81 7.62,8.89 5.08,8.89 3.17,10.79 RCB9.1 3.05,11.3 1.13,13.21 1.13,17.8 1.65,18.31 LED9.1
CB9-IN-1
  Top 0.152: HIGH-IN.1 163.83,48.26 167.64,44.45 169.54,44.45 171.45,42.55 175.26,42.55 176.53,41.27 RCB9-1.1 176.53,40.64 174.78,38.89 174.78,35.88 176.65,34.01 LED19.1
COMHN
  Top 0.152: RTERMH.1 84.24,25.48 RCOMH1.2 83.4,24.13 CBPH1.1 80.91,26.62 73.46,26.62 72.66,27.42 IC2.42
COMHN-1
  Top 0.152: IC1.42 104.66,25.92 101.18,22.44 CCOMLN_BP-1.1 102.02,20.75 RCOMML-1.1 102.02,17.78 RCOMH1-1.2
COMHP
  Top 0.152: RTERMH.2 84.24,28.88 RCOMH.2 83.4,30.48 CBPH.1 80.84,27.92 IC2.43
COMHP-1
  Top 0.152: IC1.43 112.35,25.4 107.95,25.4 104.56,22.01 CCOMLP_BP-1.1 103.72,20.75 RCOMML-1.2 103.97,18.67 RCOMH-1.2
COMLN
  Top 0.152: 76.35,22.71 76.03,22.4 RCOMML.2 RCOML1.2 | 76.35,22.71 CCOMLN_BP.1 | IC2.41 72.14,26.92 76.35,22.71
COMLN-1
  Top 0.152: RTERML.2 93.56,25.61 RCOML1-1.2 94.4,24.13 CBPL1.1 96.69,26.42 IC1.41
COMLP
  Top 0.152: IC2.40 70.31,26.42 CCOMLP_BP.1 74.33,22.4 RCOMML.1 RCOML.2
COMLP-1
  Top 0.152: RTERML.1 93.56,29 RCOML-1.2 94.4,30.48 CBPL.1 96.94,27.94 108.2,27.94 109.22,26.92 IC1.40
CVDD  (via drill 0.35)
  Top 0.152: IC2.45 64.6,28.91 64.33,29.18 64.33,30.66 v64.77,31.1 68.96,35.29 DIS_UART.1 | CCVDD.1 71.03,33.02 v69.85,33.02
  Route15 0.254: v64.77,31.1 66.04,31.1 67.96,33.02 v69.85,33.02
CVDD-1  (via drill 0.35)
  Top 0.152: 113.78,22.47 113.78,23.8 113.16,24.42 IC1.45 | IC1.52 115.86,21.72 115.55,22.02 114.31,22.02 113.82,22.51 113.78,22.47 | CCVDD-1.1 110.49,18.33 v110.49,17.78 | v113.73,22.3 113.73,22.43 113.78,22.47
  Route15 0.254: v110.49,17.78 113.73,21.02 v113.73,22.3
DVDD
  Top 0.152: IC2.49 64.71,33.68 64.71,35.35 CDVDD.1
DVDD-1
  Top 0.152: IC1.49 114.36,17.12 115.39,16.09 CDVDD-1.1
GNDH  (via drill 0.35)
  Top 0.152: v158.37,13.08 CTSREF-1.2 | 113.44,27.94 113.44,28.64 113.16,28.92 IC1.36 | 113.44,27.94 113.44,27.65 113.21,27.42 IC1.39 | 113.44,27.94 114.3,27.94 115.57,26.67 IC1.65 | v110.62,23.93 110.62,23.41 CNEG5V-1.2 110.07,20.88 CCVDD-1.2 | CNPN-1.1 v121.92,7.62 | v118.11,13.97 117.26,13.97 CDVDD-1.2 | CREFHP-1.2 v110.49,36.41 | CBPL1.2 v96.52,22.86 | CCOMLN_BP-1.2 v97.79,21.59 | CCOMLP_BP-1.2 106.68,21.17 v106.68,20.32 | v107.95,36.83 CAVDD-1.2 | D2.3 v103.38,11.3 | CBPL.2 v96.52,31.75 | CLDOIN-1.2 111.76,8.6 v111.76,7.62 | CBAT-1.1 133.13,22.86 v132.08,22.86 | HIGH-IN.30 HIGH-IN.15
  Top 0.254: IC1.36 111.49,28.92 110.36,30.05 v110.36,30.48 | IC1.46 v110.62,23.92 v110.62,23.93 | IC1.50 114.86,18.49 v115.57,17.78 | RVC0-1.1 128.27,42.55 130.3,44.58 139.19,44.58 HIGH-IN.25
  other vias: 100.36,28.65 101.6,28.62 99.06,28.62 97.79,28.62 104.14,28.6 105.41,28.6 106.68,28.6 101.6,25.76 100.33,25.76 99.06,25.76 97.79,27.15 99.06,27.15 102.87,25.4 101.6,24.13 100.33,22.86 100.33,27.15 101.6,27.15 102.92,28.6 104.17,27.13 105.38,27.1 102.87,27.15 107.95,28.6 106.65,27.1 107.95,27.13 102.87,22.86 104.14,24.13 105.41,25.24 105.41,24.13 104.14,22.86 106.68,25.26 106.68,22.86 120.02,13.34 105.41,38.1 105.41,36.83 107.95,38.1 110.49,38.1 110.36,31.75 110.49,41.91 112.39,43.81 114.3,45.72 116.84,41.91 119.38,44.45 121.92,46.99 124.46,49.53 118.11,49.53 121.92,5.08 120.65,3.81 118.11,15.24 119.38,2.54 116.2,47.62 112.39,12.45 112.39,13.84 112.39,15.24 111.76,5.08 113.28,5.08 113.28,3.56 111.76,3.56 109.22,27.94 97.16,19.05 99.06,19.05 153.67,19.68 161.29,19.68 161.93,12.7 166.37,16.51 169.54,19.68 167.64,10.79 175.26,18.41 171.45,14.61 163.19,6.99 153.67,3.81 149.22,6.35 140.97,3.81 135.89,6.35 131.44,3.81
  pour Top: 109.22,30.48 109.22,39.37 111.76,39.37 111.76,30.48
  pour Top: 107.95,31.75 107.95,39.37 105.41,39.37 105.41,31.75
  pour Top: 97.79,29.21 109.22,29.21 110.49,27.94 110.49,26.67 106.68,22.86 100.35,22.86 98.81,24.64 97.79,24.64
  pour Top: 110.49,24.13 109.22,22.86 109.22,17.78 110.49,16.51 110.49,3.81 111.76,2.54 118.11,2.54 121.92,6.35 121.92,10.16 120.65,11.43 114.3,11.43 114.3,15.24 113.03,16.51 113.03,24.13
  pour Top: 115.57,17.78 116.84,17.78 119.38,15.24 119.38,12.7 116.84,12.7 115.57,13.97
  pour Route2: 115.57,17.78 115.57,13.97 116.84,12.7 119.38,12.7 120.65,12.7 120.65,13.97 116.84,17.78
  pour Route2: 120.65,11.43 121.92,10.16 121.92,3.81 120.65,2.54 111.76,2.54 110.49,3.81 110.49,16.51 109.22,17.78 109.22,22.86 110.49,24.13 113.03,24.13 113.03,19.05 114.3,17.78 114.3,13.97 116.84,11.43
  pour Top: 123.19,50.8 177.8,50.8 177.8,24.13 158.75,5.08 130.18,5.08 114.3,20.95 114.3,41.91
  pour Route2: 96.52,31.75 99.06,31.75 100.33,29.21 109.22,29.21 110.49,27.94 110.49,26.67 106.68,22.86 106.68,11.3 103,11.3 96.52,17.78
  pour Route2: 178.63,17.97 163.19,2.54 128.27,2.54 123.19,7.62 123.19,13.34 114.3,22.23 114.3,29.21 110.49,29.21 107.95,31.75 104.14,31.75 104.14,40.64 114.3,50.8 178.63,50.8
  pour Bottom: 179.07,0 179.07,50.8 96.52,50.8 96.52,17.78 103,11.3 110.49,11.3 110.49,3.81 114.3,0
GNDL  (via drill 0.35)
  Top 0.152: v59.69,45.09 CTSREF.2 | CNPN.1 v68.58,38.1 | CLDOIN.2 79.59,37.3 v79.4,37.49 | CBAT.1 47.41,29.84 v45.97,29.84 | v72.39,30.48 CNEG5V.2 | CCVDD.2 73.2,33.48 74.12,33.48 v74.3,33.66 | IC2.46 66.86,29.42 v67.92,30.48 | CDVDD.2 v64.77,39.37 | v72.01,21.46 72.17,21.63 CCOMLP_BP.2 | CCOMLN_BP.2 78.36,23.03 v78.36,24.13 | D1.3 v75.82,12.7 | CBPH.2 v81.28,31.75 | CBPH1.2 v81.28,22.86 | CREFHP.2 v66.04,16.13 | CAVDD.2 v69.22,14.1 | IC2.65 60.33,26.67 62.23,24.77 | LOW-IN.30 LOW-IN.15
  Top 0.254: IC2.50 62.94,33.73 v63.5,34.29 | v67.44,22.91 67.44,23.32 66.34,24.42 IC2.36 64.47,24.41 64.36,24.52 | 64.36,24.52 64.36,25.7 64.58,25.92 IC2.39 | 64.36,24.52 64.12,24.77 62.23,24.77
  Top 0.305: RVC0.1 50.59,9.73 50.59,9.1 49,7.51 37.36,7.51 LOW-IN.25
  other vias: 73.66,28.58 74.93,28.58 76.2,28.58 77.47,28.58 78.74,28.58 80.01,28.58 73.89,27.28 74.98,27.28 76.2,27.28 77.47,27.28 78.74,27.28 80.01,27.28 64.77,40.64 71.12,35.56 71.12,36.83 72.39,36.83 72.39,35.56 72.42,28.58 71.15,28.58 69.85,28.58 78.74,25.94 77.47,25.96 76.2,25.96 74.98,25.96 74.04,25.96 80.01,25.96 75.36,24.69 69.85,25.4 68.58,25.4 71.12,24.51 73.53,24.38 72.39,25.4 71.41,26.26 67.44,21.59 66.04,14.99 66.04,13.84 69.22,11.43 69.22,12.83 64.77,41.91 64.77,43.18 78.74,43.18 80.01,41.91 81.28,40.64 72.01,19.81 78.61,19.81 80.52,19.81 3.17,29.21 6.35,32.38 9.53,35.56 23.5,33.66 23.5,40.01 12.7,39.37 16.51,43.18 19.68,46.99 12.06,45.72 8.89,42.55 5.71,39.37 1.91,36.2
  pour Top: 63.5,34.29 64.77,34.29 66.04,35.56 66.04,41.91 63.5,41.91
  pour Top: 67.31,30.48 67.31,40.64 69.85,43.18 77.47,43.18 80.01,40.64 80.01,34.29 76.2,30.48
  pour Top: 67.31,25.4 67.31,29.21 80.01,29.21 80.01,25.4 77.47,25.4 76.2,24.13 68.58,24.13
  pour Top: 64.77,13.84 64.77,25.4 67.49,25.4 67.49,13.84
  pour Top: 68.58,20.32 69.85,20.32 69.85,11.43 68.58,11.43
  pour Top: 63.5,13.97 63.5,30.48 62.23,31.75 62.23,44.45 73.66,44.45 76.2,46.99 76.2,49.53 20.32,49.53 0.01,29.22 0.18,0 49.53,0
  pour Route2: 0,0 0,37.47 13.34,50.8 76.2,50.8 76.2,46.99 73.66,44.45 62.23,44.45 62.23,26.67 67.31,22.86 67.31,21.59 69.85,19.05 69.85,11.43 67.31,8.89 62.87,8.89 53.98,0
  pour Route2: 63.5,34.29 64.77,34.29 66.04,35.56 66.04,43.18 63.5,43.18
  pour Route2: 67.31,40.64 67.31,30.48 76.2,30.48 81.28,35.56 81.28,43.18 69.85,43.18
  pour Route2: 76.2,12.7 81.28,17.78 81.28,29.21 81.28,31.75 80.01,31.75 77.47,29.21 67.31,29.21 67.31,25.4 68.58,24.13 71.12,24.13 71.12,12.7
  pour Bottom: 76.2,12.7 72.39,12.7 59.69,0 0,0 0,50.8 81.28,50.8 81.28,17.78
ISO_COMN
  Top 0.152: CISOL1.1 RCOML1-1.1
ISO_COMP
  Top 0.152: CISOL.1 RCOML-1.1
LDOIN
  Top 0.152: CLDOIN.1 77.7,35.75 | 77.7,35.75 77.7,34.48 74.97,31.75 68.1,31.75 66.26,29.91 65.56,29.91 65.56,29.92 IC2.47 | 77.7,35.75 T1.E
LDOIN-1
  Top 0.152: 114.07,8.57 CLDOIN-1.1
  Top 0.254: IC1.47 111.49,23.43 111.2,23.14 111.2,11.44 CLDOIN-1.1 | T2.E 114.07,8.57
N$2
  Top 0.152: T1.C 76.2,40.64 RNPN.2 CNPN.2
N$6
  Top 0.152: IC2.44 68.21,28.42 69,29.21 CNEG5V.1
N$12  (via drill 0.35)
  other vias: 54.61,2.54
N$13  (via drill 0.35)
  other vias: 51.44,3.81
N$14  (via drill 0.35)
  other vias: 53.34,6.35
N$15  (via drill 0.35)
  other vias: 57.78,5.71
N$16  (via drill 0.35)
  other vias: 60.33,8.89
N$46
  Top 0.152: RCOMH.1 CISOL.2
N$47
  Top 0.152: RCOMH1.1 CISOL1.2
N$50
  Top 0.152: D1.1 77.12,16.17 RCOML1.1 CCOMLN.2
N$51
  Top 0.152: CCOMLP.2 73.15,15.91 RCOML.1 74.52,16.17 D1.2
N$73
  Top 0.152: CNEG5V-1.1 109.88,24.37 109.88,24.38 110.42,24.92 IC1.44
N$92
  Top 0.152: T2.C 115.57,3.81 118.11,3.81 118.53,4.23 CNPN-1.2 RNPN-1.2
N$97
  Top 0.152: CCOMHP.2 106.55,11.26 RCOMH-1.1 105.06,14.39 D2.1
N$98
  Top 0.152: CCOMHN.2 RCOMH1-1.1 101.57,14.26 D2.2
N$99
  Top 0.152: COMMH.2 106.68,7.72 CCOMHP.1
N$101
  Top 0.152: COMMH.4 100.2,7.62 CCOMHN.1
N$103
  Top 0.152: CCOMLN.1 78.74,7.85 COMML.2
N$104
  Top 0.152: COMML.4 73.15,7.87 CCOMLP.1
NOT_USED_VC_CB
  Top 0.152: IC2.15 IC2.14 IC2.13 IC2.12 IC2.11 IC2.10 IC2.9 IC2.8 IC2.7 IC2.6 IC2.5 IC2.4 IC2.3 IC2.2 IC2.1 53.89,30.48 52.07,30.48 51.65,30.06 CCB10.1 | CCB10.1 49.33,30.06 CBAT.2 | CCB10.1 51.31,32.42 RBAT.2
NOT_USED_VC_CB_HIGH
  Top 0.152: IC1.1 IC1.2 IC1.3 IC1.4 IC1.5 IC1.6 IC1.7 IC1.8 IC1.9 IC1.10 IC1.11 IC1.12 IC1.13 IC1.14 IC1.15
  Top 0.254: IC1.3 124.27,23.5 128.27,23.5 130.39,21.38 CBAT-1.2 CCB10-1.1 139.91,21.38 RBAT-1.2
NPNB
  Top 0.152: IC2.48 68.3,33.3 | 73.66,34.29 74.7,35.33 T1.B
  Top 0.254: 68.3,33.3 69.3,34.29 73.66,34.29
NPNB-1
  Top 0.152: IC1.48 112.37,18.44 113.64,17.17 113.64,13.36 117.07,9.93 T2.B
REFHP
  Top 0.152: CREFHP.1 68.16,21.38 68.16,23.29 66.52,24.92 IC2.37
REFHP-1
  Top 0.152: IC1.37 111.28,28.42 109.7,30 109.7,32.66 CREFHP-1.1
RX
  Top 0.152: UART.2 71.12,48.82 70.2,49.74 65.52,49.74 61.94,46.16 IC2.52 61.93,31.58 62.2,31.32 63.69,31.32 67.44,35.07 DIS_UART.2
SRN  (via drill 0.35)
  Top 0.254: IC2.63 56.44,33.52 56.41,33.55 v53.24,33.55 | RCS2.1 38.1,35.98 CCS.1 40.3,34.51 v40.59,34.21
  Route15 0.254: v40.59,34.21 41.27,33.53 53.21,33.53 v53.24,33.55
SRN-IN
  Top 0.254: RCS2.2 36.62,35.56 35.34,34.29 SR.3
SRP  (via drill 0.35)
  Top 0.152: v53.34,31.75 55.28,31.75
  Top 0.254: 55.28,31.75 IC2.64 | RCS1.1 38.31,32.59 CCS.2 40.81,32.8 v40.87,32.74
  Route15 0.254: v40.87,32.74 41.86,31.75 v53.34,31.75
SRP-IN
  Top 0.254: SR.4 35.45,32.28 RCS1.2
TEMP1  (via drill 0.35)
  Top 0.152: IC2.61 57.44,34.71 v57.28,34.87 52.15,40.01 34.08,40.01 31.9,42.18 | 31.9,42.18 RTHRM1.2 | 31.9,42.18
  Route15 0.254: v57.28,34.87 57.28,17.27 52.07,12.06 43.18,12.06 38.1,6.99 LOW-IN.26
TEMP2  (via drill 0.35)
  Top 0.152: IC2.60 57.94,35.71 v57.73,35.92 53.01,40.64 37.25,40.64 RTHRM2.2
  Route15 0.254: LOW-IN.11 39.37,4.45 39.37,6.99 43.81,11.43 52.7,11.43 58.42,17.14 58.42,35.23 v57.73,35.92
TEMP3  (via drill 0.35)
  Top 0.152: IC2.59 58.44,36.76 v58.27,36.93 53.92,41.27 40.42,41.27 RTHRM3.2
  Route15 0.254: LOW-IN.27 40.64,6.99 44.45,10.79 53.34,10.79 59.05,16.51 59.05,36.14 v58.27,36.93
TEMP4  (via drill 0.35)
  Top 0.152: IC2.58 58.94,37.81 v58.75,38 54.84,41.91 43.6,41.91 RTHRM4.2
  Route15 0.254: LOW-IN.12 41.91,4.45 41.91,6.99 45.09,10.16 53.98,10.16 59.69,15.88 59.69,37.06 v58.75,38
TEMP5  (via drill 0.35)
  Top 0.152: IC2.57 59.44,38.83 v59.26,39.01 55.73,42.55 46.77,42.55 RTHRM5.2
  Route15 0.254: LOW-IN.28 43.18,6.99 45.72,9.53 54.61,9.53 60.33,15.24 60.33,37.95 v59.26,39.01
TEMP6  (via drill 0.35)
  Top 0.152: IC2.56 59.94,39.96 v59.77,40.13 56.72,43.18 49.95,43.18 RTHRM6.2
  Route15 0.254: LOW-IN.13 44.45,4.45 44.45,6.99 46.35,8.89 55.24,8.89 60.96,14.61 60.96,38.94 v59.77,40.13
TEMP7  (via drill 0.35)
  Top 0.152: IC2.55 60.44,40.93 v60.15,41.22 57.56,43.81 53.12,43.81 RTHRM7.2
  Route15 0.254: LOW-IN.29 45.72,6.99 46.99,8.26 55.88,8.26 61.59,13.97 61.59,39.78 v60.15,41.22
TEMP8  (via drill 0.35)
  Top 0.152: IC2.54 60.94,42.03 v60.71,42.27 58.1,44.87 RTHRM8.2
  Route15 0.254: LOW-IN.14 46.99,4.45 46.99,6.99 47.62,7.62 56.52,7.62 59.69,10.79 62.23,13.34 62.23,40.74 v60.71,42.27
TEMP9  (via drill 0.35)
  Top 0.152: IC1.61 120.36,20.14 120.77,19.74 v126.36,19.74 145.58,19.74 RTHRM1-1.2
  Route15 0.254: HIGH-IN.26 138.43,45.09 132.72,39.37 127.64,39.37 126.36,38.1 v126.36,19.74
TEMP10  (via drill 0.35)
  Top 0.152: RTHRM2-1.2 142.46,19.05 125.15,19.05 v125.09,19 121.02,19 119.86,20.15 IC1.60
  Route15 0.254: v125.09,19 125.09,38.1 127,40.01 132.08,40.01 137.16,45.09 137.16,47.62 HIGH-IN.11
TEMP11  (via drill 0.35)
  Top 0.152: RTHRM3-1.2 139.41,18.29 v123.95,18.29 121.23,18.29 119.36,20.15 IC1.59
  Route15 0.254: v123.95,18.29 123.95,38.23 126.36,40.64 131.44,40.64 135.89,45.09 HIGH-IN.27
TEMP12  (via drill 0.35)
  Top 0.152: RTHRM4-1.2 136.82,17.07 v123.85,17.07 121.94,17.07 118.86,20.15 IC1.58
  Route15 0.254: v123.85,17.07 123.85,17.12 123.19,17.78 123.19,38.73 125.73,41.27 130.81,41.27 134.62,45.09 134.62,47.62 HIGH-IN.12
TEMP13  (via drill 0.35)
  Top 0.152: RTHRM5-1.2 134.22,15.85 v123.83,15.85 122.66,15.85 118.36,20.15 IC1.57
  Route15 0.254: v123.83,15.85 122.56,17.12 122.56,39.37 125.09,41.91 130.18,41.91 133.35,45.09 HIGH-IN.28
TEMP14  (via drill 0.35)
  Top 0.152: RTHRM6-1.2 131.76,14.5 v123.85,14.5 123.29,14.5 117.86,19.93 IC1.56
  Route15 0.254: v123.85,14.5 121.92,16.43 121.92,40.64 124.14,42.86 129.86,42.86 132.08,45.09 132.08,47.62 HIGH-IN.13
TEMP15  (via drill 0.35)
  Top 0.152: RTHRM7-1.2 129.17,13.28 v123.83,13.28 123.83,13.34 117.36,19.8 IC1.55
  Route15 0.254: v123.83,13.28 121.28,15.82 121.28,41.91 123.19,43.81 129.54,43.81 130.81,45.09 HIGH-IN.29
TEMP16  (via drill 0.35)
  Top 0.152: RTHRM8-1.2 126.71,11.94 v123.83,11.94 123.19,12.57 123.19,13.21 116.86,19.54 IC1.54
  Route15 0.254: v123.83,11.94 120.65,15.11 120.65,42.55 122.74,44.63 129.09,44.63 129.54,45.09 129.54,47.62 HIGH-IN.14
TP
  Top 0.254: IC2.62 56.94,33.99 54.74,36.2 TP_NFAUL.TP
TP-1
  Top 0.152: TP_NFAUL-1.TP 126.49,21.97 121.11,21.97 120.86,21.72 IC1.62
TSREF  (via drill 0.35)
  Top 0.152: RTHRM1.1 RTHRM2.1 RTHRM3.1 RTHRM4.1 RTHRM5.1 RTHRM6.1 RTHRM7.1 RTHRM8.1 57.78,48.48 CTSREF.1 62.14,48.48 v62.23,48.39 | IC2.51 62.44,45.55 v63.93,47.04
  Route15 0.152: v63.93,47.04 62.59,48.39 v62.23,48.39
TSREF-1
  Top 0.152: IC1.51 115.35,19.9 123.19,12.06 123.19,11.04 124.92,9.31 RTHRM8-1.1 RTHRM7-1.1 RTHRM6-1.1 RTHRM5-1.1 RTHRM4-1.1 RTHRM3-1.1 RTHRM2-1.1 RTHRM1-1.1 158.12,9.31 CTSREF-1.1
TX
  Top 0.152: IC2.53 61.44,46.22 65.32,50.1 71.92,50.1 73.66,48.36 UART.1
VC0  (via drill 0.35)
  Top 0.152: IC2.35 66.22,23.92 66.78,23.36 66.78,21.89 57.12,12.24 51.47,12.24 RVC0.2 v51.44,13.97 | CVC1.2 48.26,18.41 v48.76,18.92
  Route15 0.152: v51.44,13.97 51.44,16 48.76,18.67 v48.76,18.92
VC0-1
  Top 0.152: IC1.35 111.58,29.42 111.08,29.93 111.08,31.93 117.7,38.56 126.78,38.56 128.01,39.79 RVC0-1.2 128.27,35.05 129.67,33.66 CVC1-1.2
VC1
  Top 0.152: CVC1.1 CVC2.2 | CVC1.1 46.35,17.57 RVC1.2 | CVC1.1 45,18.41 43.81,19.6 43.81,22.24 44.51,22.94 47.14,22.94 47.75,22.33 47.75,20.98 53.34,15.39 59.41,15.39 65.43,21.41 IC2.33
VC1-1
  Top 0.152: CVC2-1.2 134.37,33.66 | 134.37,33.66 CVC1-1.1 134.01,33.47 134.01,33.2 135.89,31.32 135.89,29.84 135.25,29.21 131.44,29.21 130.02,30.63 130.02,32.35 124.43,37.95 117.96,37.95 112.37,32.36 IC1.33 | RVC1-1.2 133.35,34.67 134.37,33.66
VC1-IN
  Top 0.152: RVC1.1 46.35,10.46 44.36,8.47 35.77,8.47 LOW-IN.24
VC1-IN-1
  Top 0.152: HIGH-IN.24 143.51,45.09 142.22,43.79 134.62,43.79 133.35,42.52 RVC1-1.1
VC2
  Top 0.152: CVC2.1 39.92,18.41 38.73,19.6 38.73,22.86 39.42,23.55 47.4,23.55 48.41,22.53 48.41,21.21 53.62,16 58.8,16 62.94,20.14 IC2.31 | CVC2.1 CVC3.2 | CVC2.1 41.27,17.57 RVC2.2
VC2-1
  Top 0.152: CVC3-1.2 139.45,33.66 | 139.45,33.66 CVC2-1.1 139.09,33.47 139.09,33.2 140.97,31.32 140.97,29.21 140.36,28.6 131.19,28.6 129.44,30.35 129.44,32.08 124.18,37.34 119,37.34 114.86,33.2 IC1.31 | RVC2-1.2 138.43,34.67 139.45,33.66
VC2-IN
  Top 0.152: RVC2.1 41.27,10.46 39.98,9.17 33.93,9.17 LOW-IN.23
VC2-IN-1
  Top 0.152: RVC2-1.1 140.12,43.18 144.78,43.18 146.05,44.45 HIGH-IN.23
VC3
  Top 0.152: CVC3.1 34.84,18.41 33.66,19.6 33.66,22.18 35.58,24.11 47.67,24.11 49.02,22.76 49.02,21.46 53.87,16.61 58.41,16.61 61.94,20.14 IC2.29 | CVC3.1 CVC4.2 | CVC3.1 36.2,17.57 RVC3.2
VC3-1
  Top 0.152: CVC4-1.2 144.53,33.66 | 144.53,33.66 CVC3-1.1 144.78,33.23 144.78,32.91 146.05,31.64 146.05,29.21 144.83,27.99 130.94,27.99 128.83,30.1 128.83,31.82 123.92,36.73 119.39,36.73 115.86,33.2 IC1.29 | RVC3-1.2 143.51,34.67 144.53,33.66
VC3-IN
  Top 0.152: RVC3.1 35.39,9.78 33.03,9.78 31.87,8.61 31.04,8.61 28.14,5.71 LOW-IN.22
VC3-IN-1
  Top 0.152: RVC3-1.1 144.56,42.55 146.05,42.55 148.59,45.09 HIGH-IN.22
VC4
  Top 0.152: CVC4.1 CVC5.2 | CVC4.1 31.11,17.57 RCV4.2 | CVC4.1 30.27,18.47 28.57,20.16 28.57,22.89 30.43,24.74 47.9,24.74 49.63,23.01 49.63,21.72 54.12,17.22 58.02,17.22 60.94,20.14 IC2.27
VC4-1
  Top 0.152: CVC5-1.2 149.61,33.66 | 149.61,33.66 CVC4-1.1 149.86,33.23 149.86,32.91 151.13,31.64 151.13,29.21 149.3,27.38 130.69,27.38 128.22,29.85 128.22,31.57 123.67,36.12 119.78,36.12 116.86,33.2 IC1.27 | RCV4-1.2 148.59,34.67 149.61,33.66
VC4-IN
  Top 0.152: LOW-IN.21 25.4,6.13 28.79,9.53 30.06,9.53 RCV4.1
VC4-IN-1
  Top 0.152: RCV4-1.1 148.59,41.65 151.33,44.38 151.33,46.16 HIGH-IN.21
VC5
  Top 0.152: CVC5.1 CVC6.2 | CVC5.1 26.04,17.57 RVC5.2 | CVC5.1 25.18,18.67 23.5,20.36 23.5,24.13 24.77,25.4 48.1,25.4 50.24,23.26 50.24,21.97 54.38,17.83 57.65,17.83 59.94,20.12 IC2.25
VC5-1
  Top 0.152: CVC6-1.2 154.69,33.66 | 154.69,33.66 CVC5-1.1 154.94,33.23 154.94,32.91 156.21,31.64 156.21,29.21 153.77,26.77 130.44,26.77 127.61,29.6 127.61,31.32 123.42,35.51 120.15,35.51 117.86,33.22 IC1.25 | RVC5-1.2 153.67,34.67 154.69,33.66
VC5-IN
  Top 0.152: LOW-IN.20 22.86,6.35 26.04,9.53 RVC5.1
VC5-IN-1
  Top 0.152: RVC5-1.1 HIGH-IN.20
VC6
  Top 0.152: CVC6.1 CVC7.2 | CVC6.1 20.95,17.57 RVC6.2 | CVC6.1 20.11,18.47 18.41,20.16 18.41,24.13 20.3,26.01 48.32,26.01 50.85,23.48 50.85,22.22 54.63,18.44 57.24,18.44 58.94,20.14 IC2.23
VC6-1
  Top 0.152: CVC7-1.2 159.77,33.66 | 159.77,33.66 CVC6-1.1 160.02,33.23 160.02,32.91 161.29,31.64 161.29,29.21 158.24,26.16 130.18,26.16 127,29.34 127,31.07 123.17,34.9 120.56,34.9 118.86,33.2 IC1.23 | RVC6-1.2 158.75,34.67 159.77,33.66
VC6-IN
  Top 0.152: LOW-IN.19 20.32,9.95 RVC6.1
VC6-IN-1
  Top 0.152: RVC6-1.1 158.39,41.85 158.39,42.88 156.84,44.43 156.84,45.72 HIGH-IN.19
VC7
  Top 0.152: CVC7.1 CVC8.2 | CVC7.1 15.88,17.57 RCV7.2 | CVC7.1 14.61,18.84 14.61,19.54 13.34,20.81 13.34,24.13 15.88,26.67 48.56,26.67 51.46,23.77 51.46,22.47 54.88,19.05 56.85,19.05 57.94,20.14 IC2.21
VC7-1
  Top 0.152: CVC8-1.2 164.85,33.66 | 164.85,33.66 CVC7-1.1 165.1,33.23 165.1,32.91 166.37,31.64 166.37,29.21 162.71,25.55 129.93,25.55 126.39,29.09 126.39,30.81 122.92,34.29 120.95,34.29 119.86,33.2 IC1.21 | RCV7-1.2 163.83,34.67 164.85,33.66
VC7-IN
  Top 0.152: RCV7.1 17.78,8.68 LOW-IN.18
VC7-IN-1
  Top 0.152: HIGH-IN.18 158.75,45.09 161.07,42.76 162.56,42.76 RCV7-1.1
VC8
  Top 0.152: CVC8.1 6.57,18.41 CVC9.2 | CVC8.1 10.79,17.57 RVC8.2 | CVC8.1 9.88,18.41 8.26,20.04 8.26,24.13 11.4,27.28 48.81,27.28 52.05,24.04 52.05,22.7 55.11,19.64 56.43,19.64 56.94,20.14 IC2.19
VC8-1
  Top 0.152: CVC9-1.2 169.93,33.66 | 169.93,33.66 CVC8-1.1 169.76,33.44 171.45,31.75 171.45,29.21 167.18,24.94 129.68,24.94 125.78,28.84 125.78,30.59 122.64,33.73 121.37,33.73 120.86,33.22 IC1.19 | 169.93,33.66 168.91,34.67 RVC8-1.2
VC8-IN
  Top 0.152: RVC8.1 11.43,10.58 15.24,6.77 LOW-IN.17
VC8-IN-1
  Top 0.152: HIGH-IN.17 165.1,42.55 167.85,42.55 RVC8-1.1
VC9
  Top 0.152: RVC9.2 5.71,17.31 CVC9.1 4.74,18.87 3.17,20.43 3.17,22.86 8.2,27.89 49.03,27.89 52.63,24.29 52.63,22.96 54.65,20.93 IC2.17
VC9-1
  Top 0.152: RVC9-1.2 173.99,34.63 174.84,33.78 CVC9-1.1 174.84,33.44 176.53,31.75 176.53,29.21 171.65,24.33 129.43,24.33 125.17,28.59 125.17,30.38 123.15,32.41 IC1.17
(copper drawn outside any net)
  shapes: Top area x2

## Text on the board
tNames: Feb 2024 | Drake Vogelpohl | BMS Daughterboard V2